# Altium schematic sheet PWR_LDv6.1.SchDoc
size A
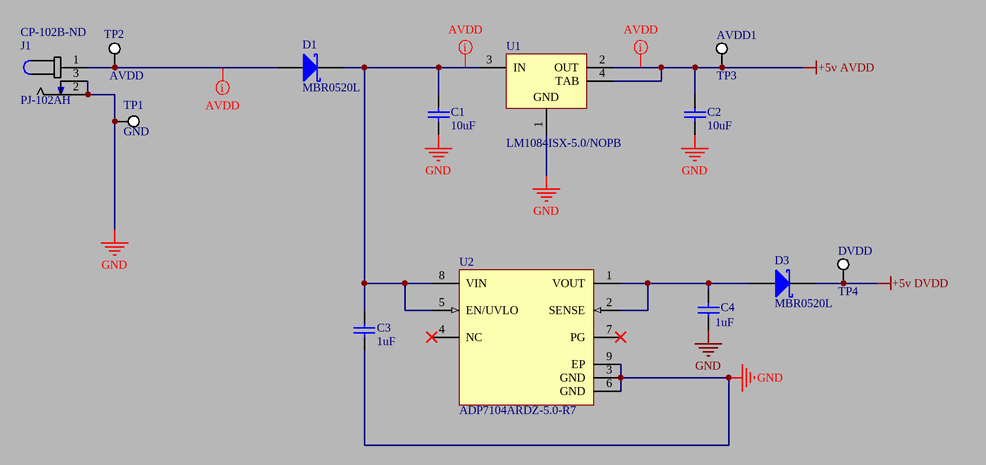
[diagram p0: PWR_LDv6.1.SchDoc]

## Parts
AVDD1  TP3  [KSTN-5015_V]
C1  10uF  [CAPC1608X90X35ML10T15]
C2  10uF  [CAPC1608X90X35ML10T15]
C3  1uF  [CAPC1608X90X35ML15T15]
C4  1uF  [CAPC1608X90X35ML15T15]
D1  MBR0520L  [ONSC-SOD-123-2-425-04_V]
D3  MBR0520L  [ONSC-SOD-123-2-425-04_V]
DVDD  TP4  [KSTN-5015_V]
J1  PJ-102AH  Supplier Part Number 1: CP-102B-ND  [*CUI_PJ-102AH]
TP1  GND  [KSTN-5015_V]
TP2  AVDD  [KSTN-5015_V]
U1  LM1084ISX-5.0/NOPB  [KTT0003B_M]
U2  ADP7104ARDZ-5.0-R7  [ADI-RD-8-2_N]

## Nets
+5v AVDD: AVDD1.1 C2.2 U1.2(OUT) U1.4(TAB)
+5v DVDD: D3.1(K) DVDD.1
GND: C1.1 C2.1 C3.2 C4.1 J1.2 J1.3 TP1.1 U1.1(GND) U2.3(GND) U2.6(GND) U2.9(EP)
NetC1_2: C1.2 C3.1 D1.1(K) U1.3(IN) U2.5(EN/UVLO) U2.8(VIN)
NetC4_2: C4.2 D3.2(A) U2.1(VOUT) U2.2(SENSE)
NetD1_2: D1.2(A) J1.1 TP2.1

Not connected (* = marked no-connect by the designer): U2 4(NC)* 7(PG)*

## Layout directives
rule Width Constraint [Pref Width = 0.254mm    Min Width = 0.254mm    Max Width = 0.254mm]: +5v AVDD, NetC1_2, NetD1_2

## Library data of the parts
AVDD1 DVDD TP1 TP2 = CMP-2000-05183-1: Test Point, White, SMT; Manufacturer: Keystone; Primary Type: PCBTestPoints; Style: Miniature; Finish Plating: SilverPlate; Material, Contact: PhosphorBronze; Material: PhosphorBronze; Datasheet URL: https://datasheet.ciiva.com/1123/5015-1123862.pdf; Thickness: 0.010In.; Manufacturer URL: http://www.keyelco.com/; Length: 0.105"(2.667mm); Datasheet Version: Mar-14; Contact Plating: Silver; Mounting Type: SurfaceMount; Termination: SMT; Type: TestPointsonTapeandReel; Height: 0.06In.; Mounting: SurfaceMount
C1 C2 = CMP-2006-02549-1: Part Number: GRM188R60G106ME47J; Manufacturer: Murata
C3 C4 = CMP-2006-04474-1: Part Number: 06036D105KAT2A; Manufacturer: AVX Interconnect / Elco
D1 D3 = CMP-2000-04926-1: Schottky Diode, 20V, 0.2A, 2-pin SOD-123, RoHS, Tape and Reel; Manufacturer: FairchildSemiconductor; Peak Forward Voltage: 0.385V; Rad Hard: No; Peak Non-Repetitive Surge Current: 5.5A; Peak Average Forward Current: 0.5A; Peak Reverse Current: 250uA; Configuration: Single; Mounting: SurfaceMount; Operating Temperature: -65to125degC; Datasheet URL: https://datasheet.ciiva.com/5739/1684450-5739282.pdf; Package Reference: SOD-123-2-425-04; Package Description: 2-Pin Small Outline Diode, Body 2.69 x 1.6 mm; Type: SchottkyDiode; Datasheet Version: Rev. C0, 03/2012; Manufacturer URL: https://www.fairchildsemi.com/; Peak Reverse Repetitive Voltage: 20V; Package: 2SOD-123; Packaging: Tape&Reel; Category: Rectifier
U1 = CMP-0062-00576-5: 5A Low Dropout Positive Regulators, 3-pin TO-263, Pb-Free; Manufacturer: Texas Instruments; PowerWise: N; PackageTopMarking: NSUZXYTTE#*LM1084*IS-5.0; CompType: LDO IC; High-Reliability: Y; PackageDescription: TO-263, Molded, .400 x .390 x .180in, 3 Lead, .1in Pitch, Surface Mount; PinCount: 3; Code_JEDEC: MO-169-AA; ComponentLink1URL: http://www.ti.com/general/docs/lit/getliterature.tsp?genericPartNumber=LM1084&fileType=pdf; PackageReference: KTT0003B; ComponentLink1Description: Datasheet URL; PartNumber: LM1084ISX-5.0/NOPB; RoHS: Y
U2 = CMP-0786-00202-1: 500 mA, Low Noise, CMOS LDO, 3.3 to 20 V Vin, 5 V Vout, Industrial, 8-pin SOIC (RD-8-2), Reel; Manufacturer: Analog Devices; Supply Current IGND @ Small Load: 400uA; Preset Vout Values (V): 5.0; Iout max: 500mA; Vin (max) (V): 20; Vin (min) (V): 3.3; ComponentLink2Description: Datasheet; ComponentLink2URL: http://www.analog.com/static/imported-files/data_sheets/ADP7104.pdf; PartNumber: ADP7104ARDZ-5.0-R7; ComponentLink3Description: Package Specification; PackageVersion: Jan-05; PackageReference: RD-8-2; Packing: Reel; ComponentLink3URL: http://www.analog.com/static/imported-files/packages/62062404671038RD_8_2.pdf; ComponentLink4Description: URL Link1; Code_JEDEC: MS-012-AA; DatasheetVersion: Rev. B; ComponentLink4URL: Product URL:http://www.analog.com/en/ADP7104/productSearch.html; PackageDescription: 8-Pin Standard Small Outline Package, Body 4.9 x 3.9 mm, Pitch 1.27 mm; ComponentLink1Description: Manufacturer URL; ComponentLink1URL: http://www.analog.com/en/index.html; Mounting Technology: Surface Mount
J1 = PJ-102AH: Value: *; Supplier 1: Digi-Key